# EAGLE design robohand (EAGLE 8.6.0)

## Sheet 1 of 5: Supply
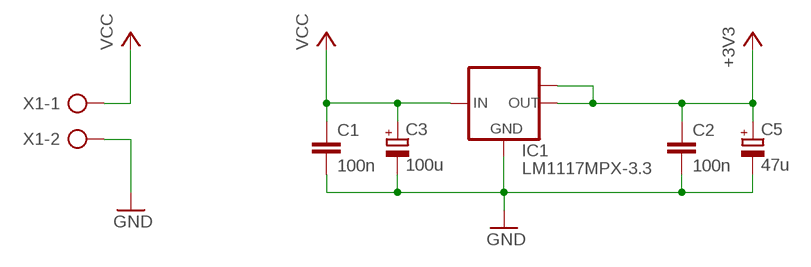
[diagram p0: schematic, sheet 1]

### Parts
C1  100n  C-EUC0805  [C0805]
C2  100n  C-EUC0805  [C0805]
C3  100u  CPOL-EUCT7343  [CT7343]
C5  47u  CPOL-EUCT3528  [CT3528]
IC1  LM1117MPX-3.3  [SOT223]
X1  AK500/2  [AK500/2]

### Nets
+3V3: C2.1 C5.+ IC1.2(OUT) IC1.TAB(OUT1) ; also sheet 2,3,5
GND: C1.2 C2.2 C3.- C5.- IC1.1(GND) X1.2 ; also sheet 2,3,5
VCC: C1.1 C3.+ IC1.3(IN) X1.1

## Sheet 2 of 5: Microcontroller
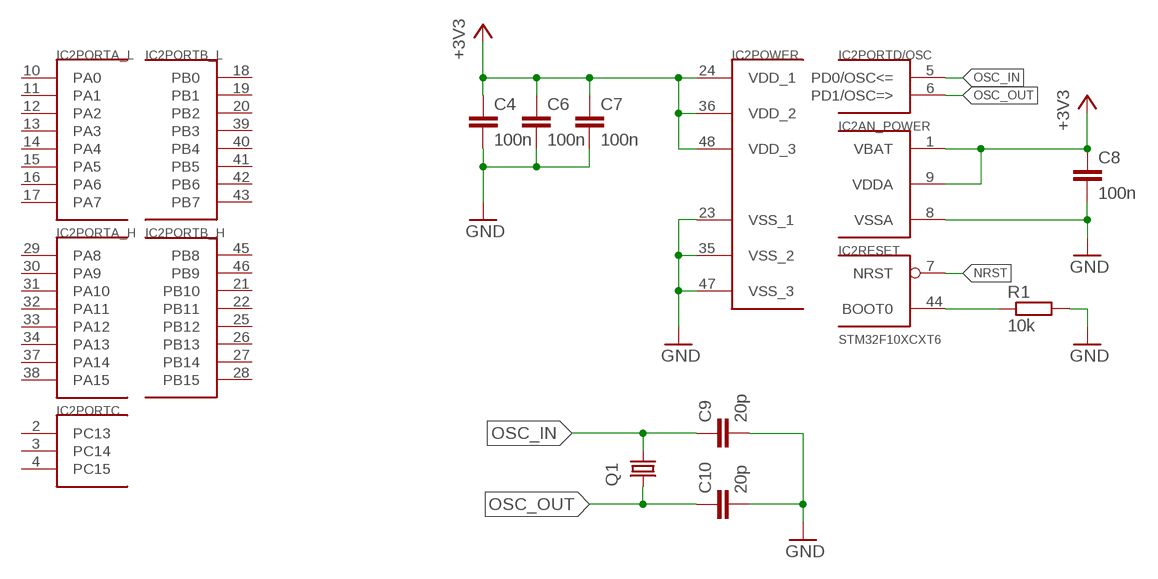
[diagram p1: schematic, sheet 2]

### Parts
C4  100n  C-EUC0805  [C0805]
C6  100n  C-EUC0805  [C0805]
C7  100n  C-EUC0805  [C0805]
C8  100n  C-EUC0805  [C0805]
C9  20p  C-EUC0805  [C0805]
C10  20p  C-EUC0805  [C0805]
IC2  STM32F10XCXT6  [TQFP48]
Q1  CRYSTALCTS406  [CTS406]
R1  10k  R-EU_R0805  [R0805]

### Nets
+3V3: C4.1 C6.1 C7.1 C8.1 IC2.1(AN_POWER:VBAT) IC2.9(AN_POWER:VDDA) IC2.24(POWER:VDD_1) IC2.36(POWER:VDD_2) IC2.48(POWER:VDD_3) ; also sheet 1,3,5
GND: C4.2 C6.2 C7.2 C8.2 C9.2 C10.2 IC2.8(AN_POWER:VSSA) IC2.23(POWER:VSS_1) IC2.35(POWER:VSS_2) IC2.47(POWER:VSS_3) R1.2 ; also sheet 1,3,5
N$4: IC2.44(RESET:BOOT0) R1.1
NRST: IC2.7(RESET:NRST)
OSC_IN: C9.1 IC2.5(PORTD/OSC:PD0/OSC<=) Q1.1
OSC_OUT: C10.1 IC2.6(PORTD/OSC:PD1/OSC=>) Q1.3
Unconnected: IC2.2(PORTC:PC13) IC2.3(PORTC:PC14) IC2.4(PORTC:PC15) IC2.10(PORTA_L:PA0) IC2.11(PORTA_L:PA1) IC2.12(PORTA_L:PA2) IC2.13(PORTA_L:PA3) IC2.14(PORTA_L:PA4) IC2.15(PORTA_L:PA5) IC2.16(PORTA_L:PA6) IC2.17(PORTA_L:PA7) IC2.18(PORTB_L:PB0) IC2.19(PORTB_L:PB1) IC2.20(PORTB_L:PB2) IC2.21(PORTB_H:PB10) IC2.22(PORTB_H:PB11) IC2.25(PORTB_H:PB12) IC2.26(PORTB_H:PB13) IC2.27(PORTB_H:PB14) IC2.28(PORTB_H:PB15) IC2.29(PORTA_H:PA8) IC2.30(PORTA_H:PA9) IC2.31(PORTA_H:PA10) IC2.32(PORTA_H:PA11) IC2.33(PORTA_H:PA12) IC2.34(PORTA_H:PA13) IC2.37(PORTA_H:PA14) IC2.38(PORTA_H:PA15) IC2.39(PORTB_L:PB3) IC2.40(PORTB_L:PB4) IC2.41(PORTB_L:PB5) IC2.42(PORTB_L:PB6) IC2.43(PORTB_L:PB7) IC2.45(PORTB_H:PB8) IC2.46(PORTB_H:PB9)

## Sheet 3 of 5: IMU
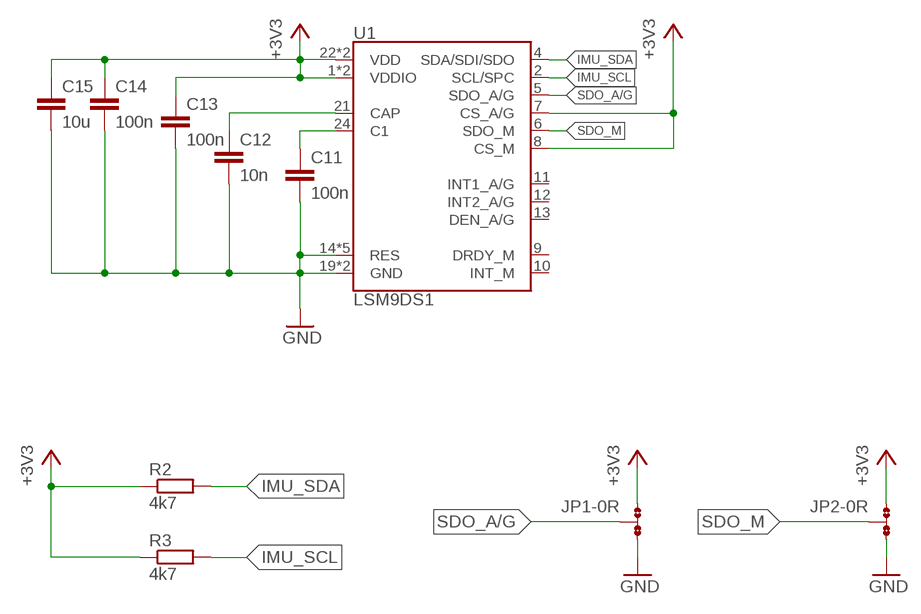
[diagram p2: schematic, sheet 3]

### Parts
C11  100n  C-EUC0805  [C0805]
C12  10n  C-EUC0805  [C0805]
C13  100n  C-EUC0805  [C0805]
C14  100n  C-EUC0805  [C0805]
C15  10u  C-EUC0805  [C0805]
JP1  0R-JUMPA  [A0R-JMP]
JP2  0R-JUMPA  [A0R-JMP]
R2  4k7  R-EU_R0805  [R0805]
R3  4k7  R-EU_R0805  [R0805]
U1  LSM9DS1  [LGA24-8X4]

### Nets
+3V3: C13.1 C14.1 C15.1 JP1.1 JP2.1 R2.1 R3.1 U1.1(VDDIO) U1.3(VDDIO) U1.7(CS_A/G) U1.8(CS_M) U1.22(VDD) U1.23(VDD) ; also sheet 1,2,5
GND: C11.2 C12.2 C13.2 C14.2 C15.2 JP1.3 JP2.3 U1.14(RES) U1.15(RES) U1.16(RES) U1.17(RES) U1.18(RES) U1.19(GND) U1.20(GND) ; also sheet 1,2,5
IMU_SCL: R3.2 U1.2(SCL/SPC)
IMU_SDA: R2.2 U1.4(SDA/SDI/SDO)
N$1: C11.1 U1.24(C1)
N$2: C12.1 U1.21(CAP)
SDO_A/G: JP1.2 U1.5(SDO_A/G)
SDO_M: JP2.2 U1.6(SDO_M)
Unconnected: U1.9(DRDY_M) U1.10(INT_M) U1.11(INT1_A/G) U1.12(INT2_A/G) U1.13(DEN_A/G)

## Sheet 4 of 5: Bluetooth
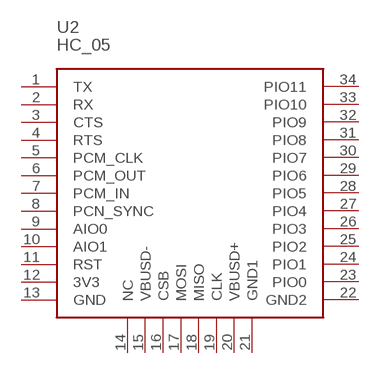
[diagram p3: schematic, sheet 4]

### Parts
U2  HC_05  [BLUETOOTH_SMD]
Unconnected: U2.1(TX) U2.2(RX) U2.3(CTS) U2.4(RTS) U2.5(PCM_CLK) U2.6(PCM_OUT) U2.7(PCM_IN) U2.8(PCN_SYNC) U2.9(AIO0) U2.10(AIO1) U2.11(RST) U2.12(3V3) U2.13(GND) U2.14(NC) U2.15(VBUSD-) U2.16(CSB) U2.17(MOSI) U2.18(MISO) U2.19(CLK) U2.20(VBUSD+) U2.21(GND1) U2.22(GND2) U2.23(PIO0) U2.24(PIO1) U2.25(PIO2) U2.26(PIO3) U2.27(PIO4) U2.28(PIO5) U2.29(PIO6) U2.30(PIO7) U2.31(PIO8) U2.32(PIO9) U2.33(PIO10) U2.34(PIO11)

## Sheet 5 of 5: Potentiometers
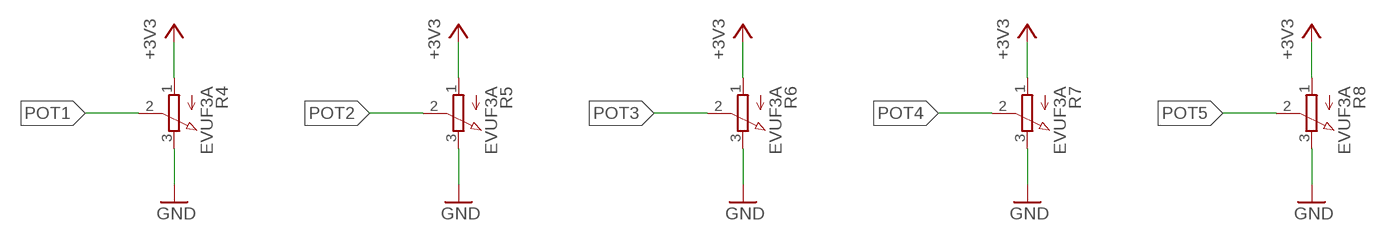
[diagram p4: schematic, sheet 5]

### Parts
R4  EVUF3A  [EVUF]
R5  EVUF3A  [EVUF]
R6  EVUF3A  [EVUF]
R7  EVUF3A  [EVUF]
R8  EVUF3A  [EVUF]

### Nets
+3V3: R4.1(A) R5.1(A) R6.1(A) R7.1(A) R8.1(A) ; also sheet 1,2,3
GND: R4.3(E) R5.3(E) R6.3(E) R7.3(E) R8.3(E) ; also sheet 1,2,3
POT1: R4.2(S)
POT2: R5.2(S)
POT3: R6.2(S)
POT4: R7.2(S)
POT5: R8.2(S)

## Library data of the parts
C1 C2 C4 C6-C15 = rcl:C-EU: CAPACITOR, European symbol; SPICEPREFIX: C
C3 C5 = rcl:CPOL-EU: POLARIZED CAPACITOR, European symbol; SPICEPREFIX: C
IC1 = lm1117:LM1117MPX-*
IC2 = stm32:STM32F10XCXT6: ST STM32F101/103 48pin LQFP
JP1 JP2 = jump-0r-smd:0R-JUMP: SMD 0R 0805 Jumper
Q1 = crystal:CRYSTAL: CRYSTAL; OC_FARNELL: unknown; OC_NEWARK: unknown
R1-R3 = rcl:R-EU_: RESISTOR, European symbol; SPICEPREFIX: R
R4-R8 = pot:EVU: 9 mm Square Rotary Potentiometers Source: Panasonic
U1 = LSM9DS1:LSM9DS1: LSM9DS1 3D accelerometer, gyroscope & magnetometer The LSM9DS1 is a system-in-package featuring a 3D digital linear acceleration sensor, a 3D digital angular rate sensor, and a 3D digital magnetic sensor. The LSM9DS1 has a linear acceleration full scale of ±2g/±4g/±8/±16 g, a magnetic field full scale of ±4/±8/±12/±16 gauss and an angular rate of ±245/±500/±2000 dps. The LSM9DS1 includes an I2 C serial bus interface supporting standard and fast mode (100 kHz and 400 kHz) and an SPI serial standard interface. Magnetic, accelerometer and gyroscope sensing can be enabled or set in power-down mode separately for smart power management. The LSM9DS1 is available in a plastic land grid array package (LGA) and it is guaranteed to operate over an extended temperature range from -40 °C to +85 °C.; PROD_ID: IC-12536
U2 = hc-05:HC_05: HC-05 Bluetooth Module
X1 = con-ptr500:AK500/2: CONNECTOR; OC_FARNELL: unknown; OC_NEWARK: unknown

## Board
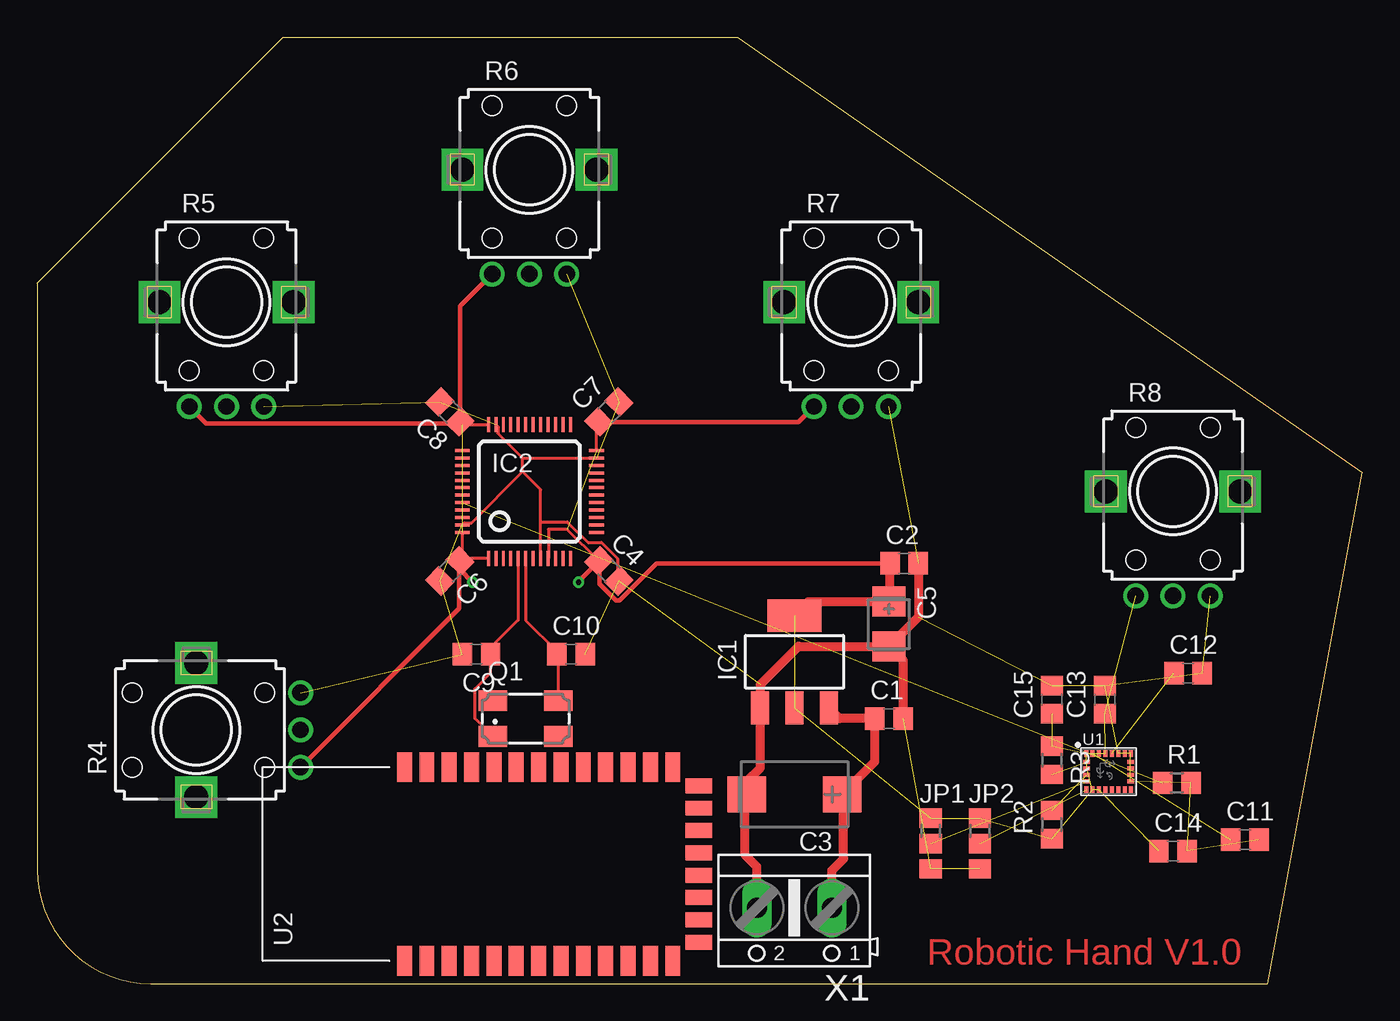
[diagram p5: board, top side]
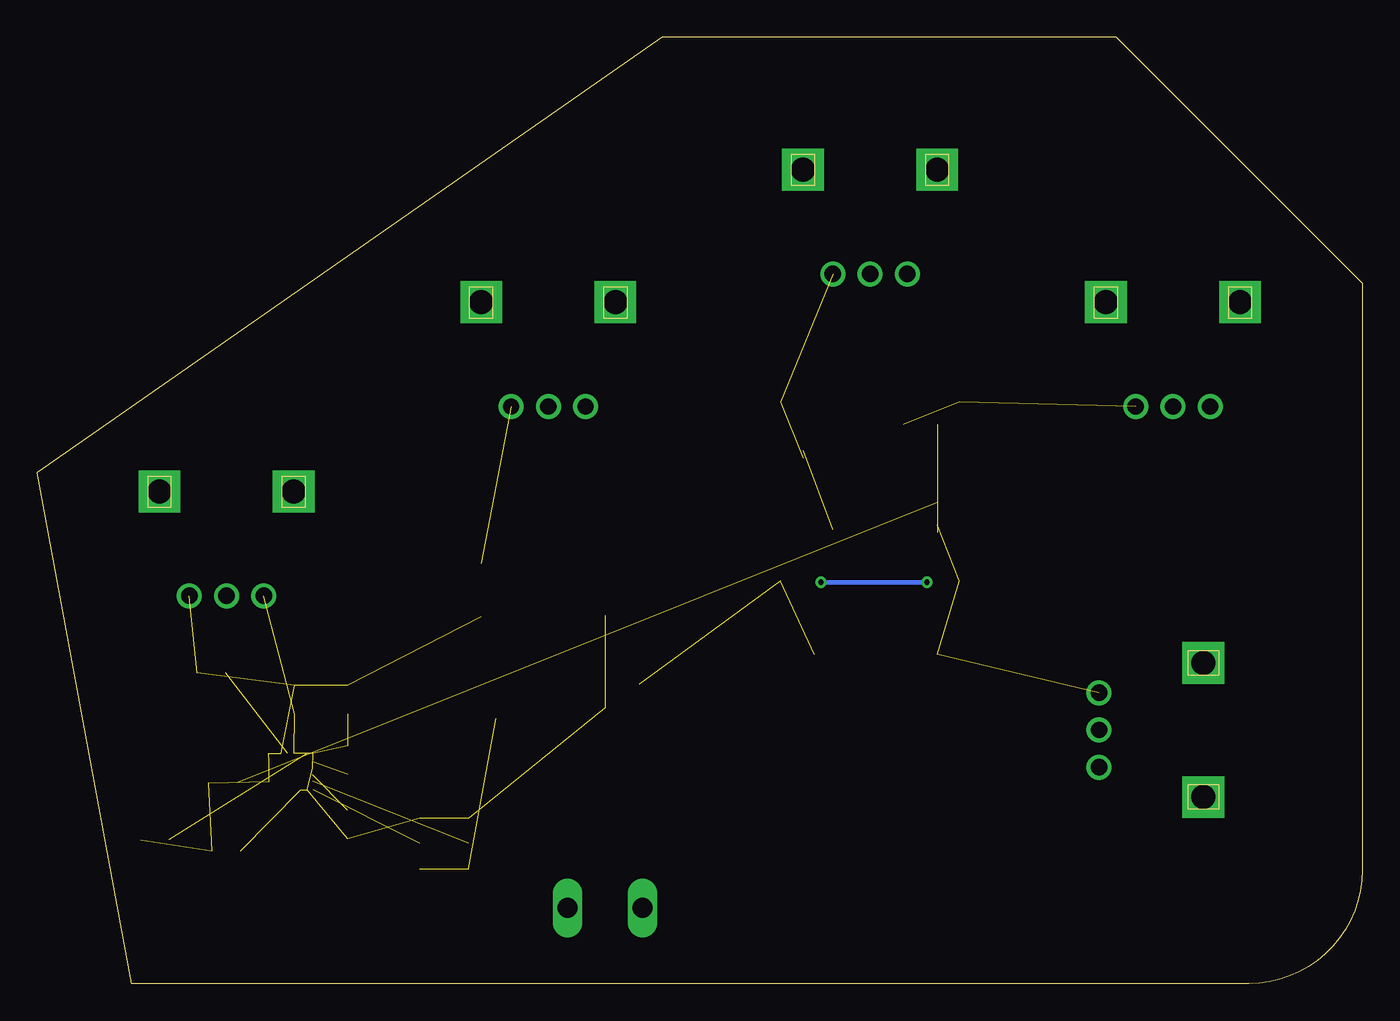
[diagram p6: board, bottom side, seen from below]

Size 88.9 x 63.5 mm. Coordinates in mm from the lower left corner, seen from the top.
Outline: 82.53,0 7.62,0 arc-90 0,7.62 0,46.99 16.51,63.5 46.99,63.5 88.9,34.29 82.55,0
Copper layers (1*16): Top 0.035mm / dielectric 1.5mm / Bottom 0.035mm
Design rules "default": minimum track width 6mil, minimum drill 0.35mm, track to track 6mil, track to pad 6mil, pad to pad 6mil, via to via 6mil, smd to smd 6mil, copper to edge 40mil, drill to drill 6mil, minimum pad ring 10mil, minimum via ring 8mil, stop-mask expansion 4mil, vias tented up to drill 0mil, thermal gap 10mil

### Footprints (pad centres in the part's own frame; a part is rotated, then mirrored left to right if it is on the bottom)
C0805 = smd 1.3 x 1.5: 1 -0.95,0; 2 0.95,0
CT7343 = smd 2.6 x 2.4: + -3.2,0; - 3.2,0
CT3528 = smd 2 x 2.2: + -1.5,0; - 1.5,0
SOT223 = smd 1.219 x 2.235: 1 -2.311,-3.099; 2 0,-3.099; 3 2.311,-3.099 | smd 3.6 x 2.2: TAB 0,3.099
TQFP48 = smd 0.2 x 1: 1 -2.75,-4.5; 2 -2.25,-4.5; 3 -1.75,-4.5; 4 -1.25,-4.5; 5 -0.75,-4.5; 6 -0.25,-4.5; 7 0.25,-4.5; 8 0.75,-4.5; 9 1.25,-4.5; 10 1.75,-4.5; 11 2.25,-4.5; 12 2.75,-4.5; 25 2.75,4.5; 26 2.25,4.5; 27 1.75,4.5; 28 1.25,4.5; 29 0.75,4.5; 30 0.25,4.5; 31 -0.25,4.5; 32 -0.75,4.5; 33 -1.25,4.5; 34 -1.75,4.5; 35 -2.25,4.5; 36 -2.75,4.5 | smd 1 x 0.2: 13 4.5,-2.75; 14 4.5,-2.25; 15 4.5,-1.75; 16 4.5,-1.25; 17 4.5,-0.75; 18 4.5,-0.25; 19 4.5,0.25; 20 4.5,0.75; 21 4.5,1.25; 22 4.5,1.75; 23 4.5,2.25; 24 4.5,2.75; 37 -4.5,2.75; 38 -4.5,2.25; 39 -4.5,1.75; 40 -4.5,1.25; 41 -4.5,0.75; 42 -4.5,0.25; 43 -4.5,-0.25; 44 -4.5,-0.75; 45 -4.5,-1.25; 46 -4.5,-1.75; 47 -4.5,-2.25; 48 -4.5,-2.75
A0R-JMP = smd 1.5 x 1.3: 1 0,1.7; 2 0,0; 3 0,-1.7
CTS406 = smd 1.9 x 1.4: 1 -2.2,-1.2; 2 2.2,-1.2; 3 2.2,1.2; 4 -2.2,1.2
R0805 = smd 1.3 x 1.5: 1 -0.95,0; 2 0.95,0
EVUF = drill 1.1 pad 1.676: 1 -2.5,-7; 2 0,-7; 3 2.5,-7 | drill 1.6 pad 2.8 square: M1 4.5,0; M2 -4.5,0
LGA24-8X4 = smd 0.27 x 0.45: 1 -1.505,1.225; 6 -1.505,-1.225; 7 -1.075,-1.225; 8 -0.645,-1.225; 9 -0.215,-1.225; 10 0.215,-1.225; 11 0.645,-1.225; 12 1.075,-1.225; 13 1.505,-1.225; 18 1.505,1.225; 19 1.075,1.225; 20 0.645,1.225; 21 0.215,1.225; 22 -0.215,1.225; 23 -0.645,1.225; 24 -1.075,1.225 | smd 0.45 x 0.27: 2 -1.475,0.645; 3 -1.475,0.215; 4 -1.475,-0.215; 5 -1.475,-0.645; 14 1.475,-0.645; 15 1.475,-0.215; 16 1.475,0.215; 17 1.475,0.645
BLUETOOTH_SMD = smd 2 x 1: 1 -6.35,3.81; 2 -6.35,2.31; 3 -6.35,0.81; 4 -6.35,-0.69; 5 -6.35,-2.19; 6 -6.35,-3.69; 7 -6.35,-5.19; 8 -6.35,-6.69; 9 -6.35,-8.19; 10 -6.35,-9.69; 11 -6.35,-11.19; 12 -6.35,-12.69; 13 -6.35,-14.19; 22 6.65,-14.19; 23 6.65,-12.69; 24 6.65,-11.19; 25 6.65,-9.69; 26 6.65,-8.19; 27 6.65,-6.69; 28 6.65,-5.19; 29 6.65,-3.69; 30 6.65,-2.19; 31 6.65,-0.69; 32 6.65,0.81; 33 6.65,2.31; 34 6.65,3.81 | smd 1 x 1.8: 14 -5.1,-15.94; 15 -3.6,-15.94; 16 -2.1,-15.94; 17 -0.6,-15.94; 18 0.9,-15.94; 19 2.4,-15.94; 20 3.9,-15.94; 21 5.4,-15.94
AK500/2 = drill 1.321 long: 1 -2.515,0; 2 2.515,0

### Placement (x,y rotation side)
C1  57.15,17.78 0 top
C2  58.17,28.19 0 top
C3  50.8,12.7 180 top
C4  38.35,27.69 315 top
C5  57.15,24.13 270 top
C6  27.69,27.69 225 top
C7  38.35,38.35 45 top
C8  27.69,38.35 135 top
C9  29.46,22.1 180 top
C10  35.81,22.1 0 top
C11  81.03,9.65 0 top
C12  77.22,20.83 0 top
C13  71.63,19.05 90 top
C14  76.2,8.89 0 top
C15  68.07,19.05 90 top
IC1  50.8,21.59 0 top
IC2  33.02,33.02 0 top
JP1  59.94,9.4 0 top
JP2  63.25,9.4 0 top
Q1  32.77,17.78 0 top
R1  76.45,13.46 0 top
R2  68.07,10.67 90 top
R3  68.07,14.99 270 top
R4  10.67,17.02 90 top
R5  12.7,45.72 0 top
R6  33.02,54.61 0 top
R7  54.61,45.72 0 top
R8  76.2,33.02 0 top
U1  71.88,14.22 0 top
U2  28.45,7.87 90 top
X1  50.8,5.08 180 top

### Tracks (layer width: path | path; a pad name or v marks a point on that pad's centre or on a via)
+3V3  (via drill 0.35)  (17 unrouted)
  Top 0.203: IC2.24 37.52,37.52 C7.1 | C4.1 35.56,30.48 34.29,30.48 34.29,28.54 IC2.9 | IC2.1 28.52,28.52 | 28.52,28.52 C6.1 | IC2.48 28.52,28.52 | C8.1 28.45,37.59 28.52,37.52 IC2.36
  Top 0.305: C2.1 41.56,28.19 39.08,25.72 38.83,25.72 37.73,26.82 37.73,28.31 C4.1 36.32,27 v36.32,26.92 | C7.1 51.07,37.68 R7.1 | C8.1 28.36,45.45 R6.1 | v29.21,26.92 28.36,27.78 C6.1 28.31,28.31 28.31,25.16 R4.1 | 28.45,37.59 15.69,37.59 15.67,37.58 11.34,37.58 R5.1
  Top 0.61: IC1.TAB 51.74,25.63 C5.+ 57.22,25.7 C2.1
  Bottom 0.305: v36.32,26.92 v29.21,26.92
GND  (26 unrouted)
  Top 0.203: IC2.35 30.92,37.37 30.92,36.92 32.56,35.27 | 32.56,35.27 IC2.23 | IC2.47 28.67,30.92 29.12,30.92 32.56,34.35 | 32.56,34.35 32.56,35.27 | IC2.8 33.77,30.99 | 33.77,30.99 33.77,33.14 32.56,34.35 | C4.2 38.93,27.11 38.93,28.53 37.86,29.6 36.94,29.6 35.55,30.99 33.77,30.99
  Top 0.61: X1.2 48.28,7.85 47.5,8.64 47.5,12.6 C3.- 47.6,13.56 48.51,14.48 48.51,18.47 IC1.1 48.51,18.52 48.51,20.07 51.08,22.63 C5.- | C1.2 58.1,21.68 C5.- | C2.2 59.12,24.6 C5.-
IMU_SCL  (1 unrouted)
IMU_SDA  (1 unrouted)
N$1  (1 unrouted)
N$2  (1 unrouted)
N$4  (1 unrouted)
OSC_IN
  Top 0.203: IC2.5 32.27,24.4 30.41,22.54 C9.1 30.41,20.84 29.36,19.79 29.36,17.78 Q1.1
OSC_OUT
  Top 0.203: IC2.6 32.77,24.38 34.86,22.29 C10.1 34.97,22 Q1.3
SDO_A/G  (1 unrouted)
SDO_M  (1 unrouted)
VCC
  Top 0.61: X1.1 53.31,7.59 54.1,8.38 54.1,12.6 C3.+ 56.2,14.9 C1.1 53.82,17.78 IC1.3

### Text on the board
Top: Robotic Hand V1.0